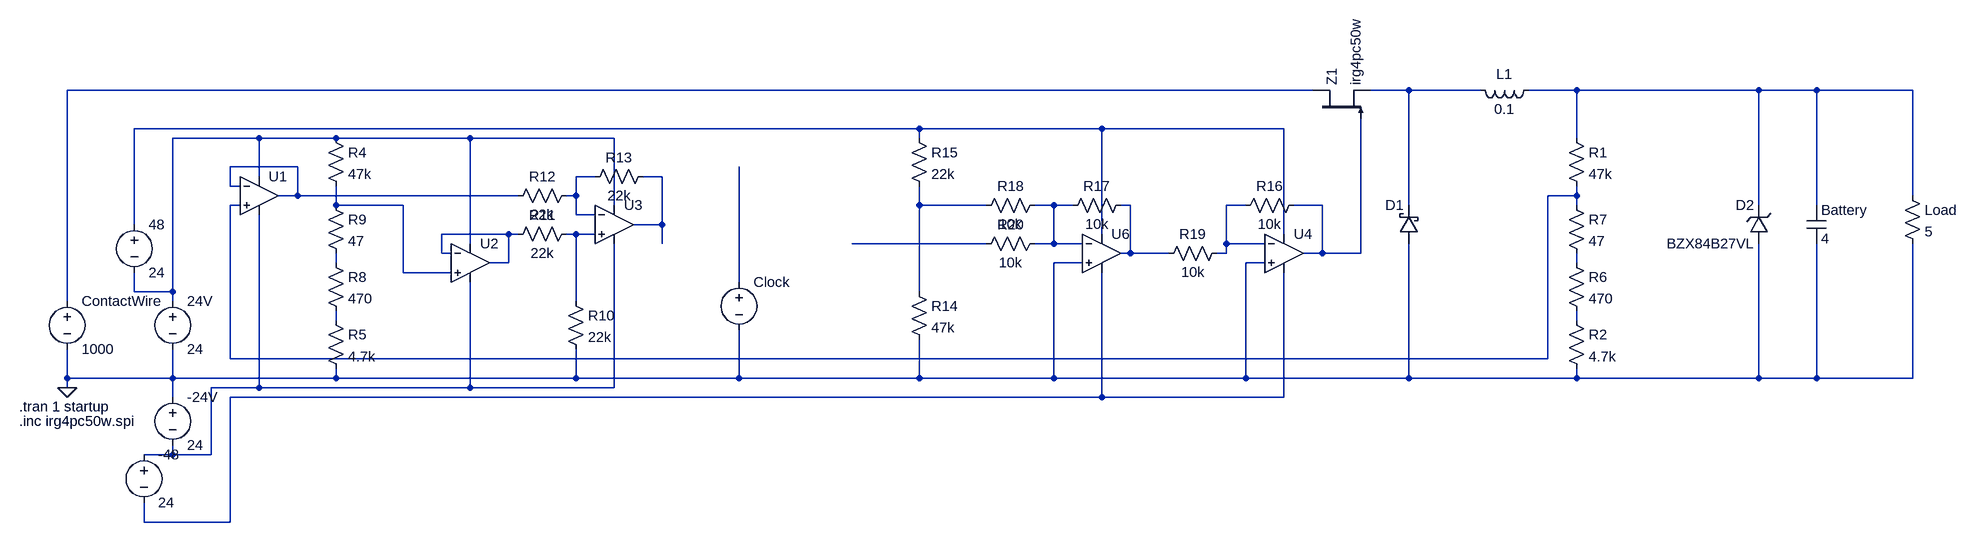
[diagram p0: schematic dc_dc_converter_reduced_v2.asc]
dc_dc_converter_reduced_v2.asc, the LTspice schematic file:
Version 4
SHEET 1 5120 680
WIRE 4032 -288 672 -288
WIRE 4192 -288 4128 -288
WIRE 4320 -288 4192 -288
WIRE 4480 -288 4400 -288
WIRE 4784 -288 4480 -288
WIRE 4880 -288 4784 -288
WIRE 5040 -288 4880 -288
WIRE 3376 -224 784 -224
WIRE 3680 -224 3376 -224
WIRE 3984 -224 3680 -224
WIRE 992 -208 848 -208
WIRE 1120 -208 992 -208
WIRE 1344 -208 1120 -208
WIRE 1584 -208 1344 -208
WIRE 3376 -208 3376 -224
WIRE 4480 -208 4480 -288
WIRE 1056 -160 944 -160
WIRE 992 -144 992 -208
WIRE 1552 -144 1520 -144
WIRE 1664 -144 1632 -144
WIRE 944 -128 944 -160
WIRE 960 -128 944 -128
WIRE 1056 -112 1056 -160
WIRE 1056 -112 1024 -112
WIRE 1424 -112 1056 -112
WIRE 1520 -112 1520 -144
WIRE 1520 -112 1504 -112
WIRE 4480 -112 4480 -128
WIRE 4480 -112 4432 -112
WIRE 5040 -112 5040 -288
WIRE 960 -96 944 -96
WIRE 1120 -96 1120 -128
WIRE 1232 -96 1120 -96
WIRE 1584 -96 1584 -208
WIRE 3376 -96 3376 -128
WIRE 3488 -96 3376 -96
WIRE 3600 -96 3568 -96
WIRE 3632 -96 3600 -96
WIRE 3728 -96 3712 -96
WIRE 3920 -96 3888 -96
WIRE 4048 -96 4000 -96
WIRE 4192 -96 4192 -288
WIRE 4480 -96 4480 -112
WIRE 4784 -96 4784 -288
WIRE 4880 -96 4880 -288
WIRE 1520 -80 1520 -112
WIRE 1552 -80 1520 -80
WIRE 784 -64 784 -224
WIRE 1664 -64 1664 -144
WIRE 1664 -64 1616 -64
WIRE 1408 -48 1296 -48
WIRE 1424 -48 1408 -48
WIRE 1520 -48 1504 -48
WIRE 1552 -48 1520 -48
WIRE 3680 -48 3680 -224
WIRE 3984 -48 3984 -224
WIRE 1344 -32 1344 -208
WIRE 1664 -32 1664 -64
WIRE 3488 -32 3264 -32
WIRE 3600 -32 3600 -96
WIRE 3600 -32 3568 -32
WIRE 3648 -32 3600 -32
WIRE 3888 -32 3888 -96
WIRE 3952 -32 3888 -32
WIRE 1296 -16 1296 -48
WIRE 1312 -16 1296 -16
WIRE 3728 -16 3728 -96
WIRE 3728 -16 3712 -16
WIRE 3792 -16 3728 -16
WIRE 3888 -16 3888 -32
WIRE 3888 -16 3872 -16
WIRE 4048 -16 4048 -96
WIRE 4048 -16 4016 -16
WIRE 4112 -16 4112 -240
WIRE 4112 -16 4048 -16
WIRE 1120 0 1120 -16
WIRE 1408 0 1408 -48
WIRE 1408 0 1376 0
WIRE 3648 0 3600 0
WIRE 3952 0 3920 0
WIRE 4480 0 4480 -16
WIRE 1232 16 1232 -96
WIRE 1312 16 1232 16
WIRE 1792 32 1792 -160
WIRE 784 48 784 16
WIRE 848 48 848 -208
WIRE 848 48 784 48
WIRE 3376 48 3376 -96
WIRE 672 64 672 -288
WIRE 848 64 848 48
WIRE 1520 64 1520 -48
WIRE 1120 96 1120 80
WIRE 4480 96 4480 80
WIRE 944 160 944 -96
WIRE 4432 160 4432 -112
WIRE 4432 160 944 160
WIRE 672 192 672 144
WIRE 848 192 848 144
WIRE 848 192 672 192
WIRE 1120 192 1120 176
WIRE 1120 192 848 192
WIRE 1520 192 1520 144
WIRE 1520 192 1120 192
WIRE 1792 192 1792 112
WIRE 1792 192 1520 192
WIRE 3376 192 3376 128
WIRE 3376 192 1792 192
WIRE 3600 192 3600 0
WIRE 3600 192 3376 192
WIRE 3920 192 3920 0
WIRE 3920 192 3600 192
WIRE 4192 192 4192 -32
WIRE 4192 192 3920 192
WIRE 4480 192 4480 176
WIRE 4480 192 4192 192
WIRE 4784 192 4784 -32
WIRE 4784 192 4480 192
WIRE 4880 192 4880 -32
WIRE 4880 192 4784 192
WIRE 5040 192 5040 -32
WIRE 5040 192 4880 192
WIRE 672 208 672 192
WIRE 992 208 992 -80
WIRE 992 208 912 208
WIRE 1344 208 1344 32
WIRE 1344 208 992 208
WIRE 1584 208 1584 -32
WIRE 1584 208 1344 208
WIRE 848 224 848 192
WIRE 3680 224 3680 16
WIRE 3680 224 944 224
WIRE 3984 224 3984 16
WIRE 3984 224 3680 224
WIRE 848 320 848 304
WIRE 848 320 800 320
WIRE 912 320 912 208
WIRE 912 320 848 320
WIRE 800 432 800 400
WIRE 944 432 944 224
WIRE 944 432 800 432
FLAG 672 208 0
SYMBOL voltage 672 48 R0
SYMATTR InstName ContactWire
SYMATTR Value 1000
SYMBOL Misc\\NIGBT 4032 -240 R270
SYMATTR InstName Z1
SYMATTR Value irg4pc50w
SYMATTR Prefix X
SYMBOL res 4464 -224 R0
SYMATTR InstName R1
SYMATTR Value 47k
SYMBOL res 4464 80 R0
SYMATTR InstName R2
SYMATTR Value 4.7k
SYMBOL cap 4864 -96 R0
SYMATTR InstName Battery
SYMATTR Value 4
SYMATTR SpiceLine Rser=25m IC=24
SYMBOL ind 4416 -304 R90
WINDOW 0 5 56 VBottom 2
WINDOW 3 32 56 VTop 2
SYMATTR InstName L1
SYMATTR Value 0.1
SYMBOL schottky 4208 -32 R180
WINDOW 0 24 64 Left 2
WINDOW 3 24 0 Invisible 2
SYMATTR InstName D1
SYMATTR Value RBR30T60A
SYMATTR Description Diode
SYMATTR Type diode
SYMBOL zener 4800 -32 R180
WINDOW 0 24 64 Left 2
WINDOW 3 24 0 Left 2
SYMATTR InstName D2
SYMATTR Value BZX84B27VL
SYMATTR Description Diode
SYMATTR Type diode
SYMBOL res 5024 -128 R0
SYMATTR InstName Load
SYMATTR Value 5
SYMBOL Opamps\\UniversalOpamp2 992 -112 R0
SYMATTR InstName U1
SYMBOL voltage 848 48 R0
SYMATTR InstName 24V
SYMATTR Value 24
SYMBOL res 1104 -224 R0
SYMATTR InstName R4
SYMATTR Value 47k
SYMBOL res 1104 80 R0
SYMATTR InstName R5
SYMATTR Value 4.7k
SYMBOL Opamps\\UniversalOpamp2 1344 0 R0
SYMATTR InstName U2
SYMBOL res 4464 -16 R0
SYMATTR InstName R6
SYMATTR Value 470
SYMBOL res 4464 -112 R0
SYMATTR InstName R7
SYMATTR Value 47
SYMBOL res 1104 -16 R0
SYMATTR InstName R8
SYMATTR Value 470
SYMBOL res 1104 -112 R0
SYMATTR InstName R9
SYMATTR Value 47
SYMBOL Opamps\\UniversalOpamp2 1584 -64 R0
SYMATTR InstName U3
SYMBOL res 1504 48 R0
SYMATTR InstName R10
SYMATTR Value 22k
SYMBOL res 1520 -64 R90
WINDOW 0 0 56 VBottom 2
WINDOW 3 32 56 VTop 2
SYMATTR InstName R11
SYMATTR Value 22k
SYMBOL res 1520 -128 R90
WINDOW 0 0 56 VBottom 2
WINDOW 3 32 56 VTop 2
SYMATTR InstName R12
SYMATTR Value 22k
SYMBOL res 1648 -160 R90
WINDOW 0 0 56 VBottom 2
WINDOW 3 32 56 VTop 2
SYMATTR InstName R13
SYMATTR Value 22k
SYMBOL voltage 848 208 R0
SYMATTR InstName -24V
SYMATTR Value 24
SYMBOL res 3360 32 R0
SYMATTR InstName R14
SYMATTR Value 47k
SYMBOL res 3360 -224 R0
SYMATTR InstName R15
SYMATTR Value 22k
SYMBOL voltage 784 -80 R0
SYMATTR InstName 48
SYMATTR Value 24
SYMBOL voltage 800 304 R0
SYMATTR InstName -48
SYMATTR Value 24
SYMBOL Opamps\\UniversalOpamp2 3680 -16 R0
SYMATTR InstName U6
SYMBOL res 3728 -112 R90
WINDOW 0 0 56 VBottom 2
WINDOW 3 32 56 VTop 2
SYMATTR InstName R17
SYMATTR Value 10k
SYMBOL res 3584 -112 R90
WINDOW 0 0 56 VBottom 2
WINDOW 3 32 56 VTop 2
SYMATTR InstName R18
SYMATTR Value 10k
SYMBOL res 3584 -48 R90
WINDOW 0 0 56 VBottom 2
WINDOW 3 32 56 VTop 2
SYMATTR InstName R20
SYMATTR Value 10k
SYMBOL Opamps\\UniversalOpamp2 3984 -16 R0
SYMATTR InstName U4
SYMBOL res 4016 -112 R90
WINDOW 0 0 56 VBottom 2
WINDOW 3 32 56 VTop 2
SYMATTR InstName R16
SYMATTR Value 10k
SYMBOL res 3888 -32 R90
WINDOW 0 0 56 VBottom 2
WINDOW 3 32 56 VTop 2
SYMATTR InstName R19
SYMATTR Value 10k
SYMBOL voltage 1792 16 R0
WINDOW 3 24 96 Invisible 2
SYMATTR InstName Clock
SYMATTR Value PULSE(0 24 0 1u 1u 271n 542n)
TEXT 592 240 Left 2 !.tran 1 startup
TEXT 592 264 Left 2 !.inc irg4pc50w.spi

The netlist it stands for:
* dc_dc_converter_reduced_v2.asc
V§ContactWire N001 0 1000
XZ1 N001 N015 N002 irg4pc50w  ; pins C G E
R1 N003 N009 47k
R2 N023 0 4.7k
C§Battery N003 0 4 Rser=25m IC=24
L1 N003 N002 0.1
D1 0 N002 RBR30T60A
D2 0 N003 BZX84B27VL
R§Load N003 0 5
XU1 N009 N006 N005 N024 N006 level.2 Avol=1Meg GBW=10Meg Slew=10Meg ilimit=25m rail=0 Vos=0 phimargin=45 en=0 enk=0 in=0 ink=0 Rin=500Meg  ; pins IN+ IN- V+ V- OUT
V§24V N005 0 24
R4 N005 N010 47k
R5 N022 0 4.7k
XU2 N010 N016 N005 N024 N016 level.2 Avol=1Meg GBW=10Meg Slew=10Meg ilimit=25m rail=0 Vos=0 phimargin=45 en=0 enk=0 in=0 ink=0 Rin=500Meg  ; pins IN+ IN- V+ V- OUT
R6 N020 N023 470
R7 N009 N020 47
R8 N019 N022 470
R9 N010 N019 47
XU3 N017 N007 N005 N024 N008 level.2 Avol=1Meg GBW=10Meg Slew=10Meg ilimit=25m rail=0 Vos=0 phimargin=45 en=0 enk=0 in=0 ink=0 Rin=500Meg  ; pins IN+ IN- V+ V- OUT
R10 N017 0 22k
R11 N017 N016 22k
R12 N007 N006 22k
R13 N008 N007 22k
V§-24V 0 N024 24
R14 N011 0 47k
R15 N004 N011 22k
V§48 N004 N005 24
V§-48 N024 N025 24
XU6 0 N012 N004 N025 N013 level.2 Avol=1Meg GBW=10Meg Slew=10Meg ilimit=25m rail=0 Vos=0 phimargin=45 en=0 enk=0 in=0 ink=0 Rin=500Meg  ; pins IN+ IN- V+ V- OUT
R17 N013 N012 10k
R18 N012 N011 10k
R20 N012 N018 10k
XU4 0 N014 N004 N025 N015 level.2 Avol=1Meg GBW=10Meg Slew=10Meg ilimit=25m rail=0 Vos=0 phimargin=45 en=0 enk=0 in=0 ink=0 Rin=500Meg  ; pins IN+ IN- V+ V- OUT
R16 N015 N014 10k
R19 N014 N013 10k
V§Clock N021 0 PULSE(0 24 0 1u 1u 271n 542n)
.model D D
.lib standard.dio
.tran 1 startup
.inc irg4pc50w.spi
.lib UniversalOpamps2.sub
.backanno
.end